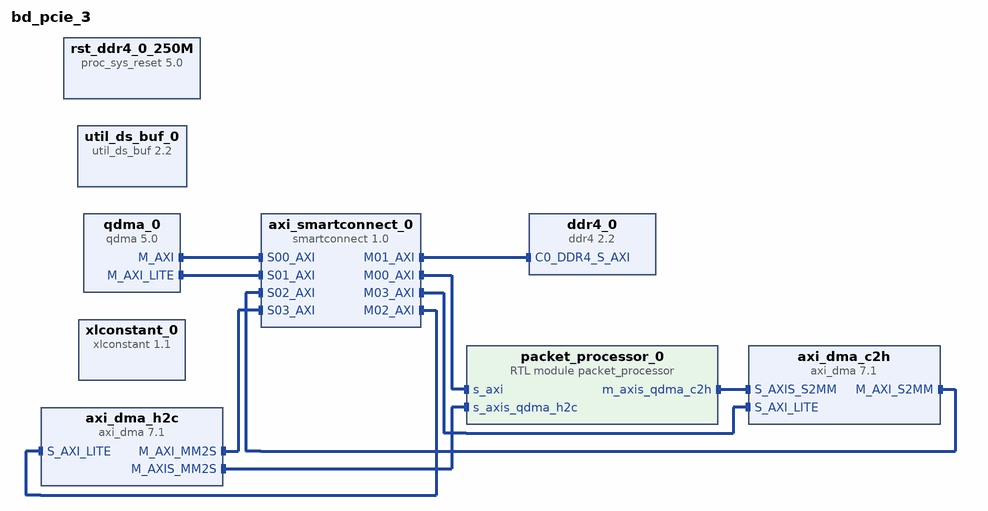
[diagram p0: block diagram of the top level]
# Vivado block design bd_pcie_3, xcvu9p-flga2104-2L-e, Vivado 2023.2
create_bd_design bd_pcie_3

create_bd_cell -type ip -vlnv xilinx.com:ip:qdma:5.0 qdma_0
set_property -dict [list \
  CONFIG.MAILBOX_ENABLE true \
  CONFIG.PCIE_BOARD_INTERFACE pci_express_x16 \
  CONFIG.SYS_RST_N_BOARD_INTERFACE pcie_perstn \
  CONFIG.axisten_freq 250 \
  CONFIG.dma_intf_sel_qdma AXI_MM \
  CONFIG.mode_selection Advanced \
  CONFIG.pf0_bar2_enabled_qdma true \
] [get_bd_cells qdma_0]
create_bd_cell -type ip -vlnv xilinx.com:ip:xlconstant:1.1 xlconstant_0
create_bd_cell -type ip -vlnv xilinx.com:ip:util_ds_buf:2.2 util_ds_buf_0
set_property -dict {CONFIG.DIFF_CLK_IN_BOARD_INTERFACE pcie_refclk CONFIG.USE_BOARD_FLOW true} [get_bd_cells util_ds_buf_0]
create_bd_cell -type ip -vlnv xilinx.com:ip:ddr4:2.2 ddr4_0
set_property -dict [list \
  CONFIG.C0_CLOCK_BOARD_INTERFACE default_250mhz_clk1 \
  CONFIG.C0_DDR4_BOARD_INTERFACE ddr4_sdram_c1_062 \
  CONFIG.RESET_BOARD_INTERFACE reset \
] [get_bd_cells ddr4_0]
create_bd_cell -type ip -vlnv xilinx.com:ip:smartconnect:1.0 axi_smartconnect_0
set_property -dict {CONFIG.HAS_ARESETN 1 CONFIG.NUM_CLKS 2 CONFIG.NUM_MI 4 CONFIG.NUM_SI 4} [get_bd_cells axi_smartconnect_0]
create_bd_cell -type ip -vlnv xilinx.com:ip:proc_sys_reset:5.0 rst_ddr4_0_250M
create_bd_cell -type module -reference packet_processor packet_processor_0
create_bd_cell -type ip -vlnv xilinx.com:ip:axi_dma:7.1 axi_dma_h2c
create_bd_cell -type ip -vlnv xilinx.com:ip:axi_dma:7.1 axi_dma_c2h

# ---- connections ----

connect_bd_intf_net [get_bd_intf_pins axi_dma_c2h/M_AXI_S2MM] [get_bd_intf_pins axi_smartconnect_0/S02_AXI]
connect_bd_intf_net [get_bd_intf_pins axi_dma_h2c/M_AXIS_MM2S] [get_bd_intf_pins packet_processor_0/s_axis_qdma_h2c]
connect_bd_intf_net [get_bd_intf_pins axi_dma_h2c/M_AXI_MM2S] [get_bd_intf_pins axi_smartconnect_0/S03_AXI]
connect_bd_intf_net [get_bd_intf_pins axi_smartconnect_0/M00_AXI] [get_bd_intf_pins packet_processor_0/s_axi]
connect_bd_intf_net [get_bd_intf_pins axi_smartconnect_0/M01_AXI] [get_bd_intf_pins ddr4_0/C0_DDR4_S_AXI]
connect_bd_intf_net [get_bd_intf_pins axi_smartconnect_0/M02_AXI] [get_bd_intf_pins axi_dma_h2c/S_AXI_LITE]
connect_bd_intf_net [get_bd_intf_pins axi_smartconnect_0/M03_AXI] [get_bd_intf_pins axi_dma_c2h/S_AXI_LITE]
connect_bd_intf_net [get_bd_intf_pins packet_processor_0/m_axis_qdma_c2h] [get_bd_intf_pins axi_dma_c2h/S_AXIS_S2MM]
connect_bd_intf_net [get_bd_intf_pins qdma_0/M_AXI] [get_bd_intf_pins axi_smartconnect_0/S00_AXI]
connect_bd_intf_net [get_bd_intf_pins qdma_0/M_AXI_LITE] [get_bd_intf_pins axi_smartconnect_0/S01_AXI]

validate_bd_design
save_bd_design
